# EAGLE schematic player (EAGLE 6.4)
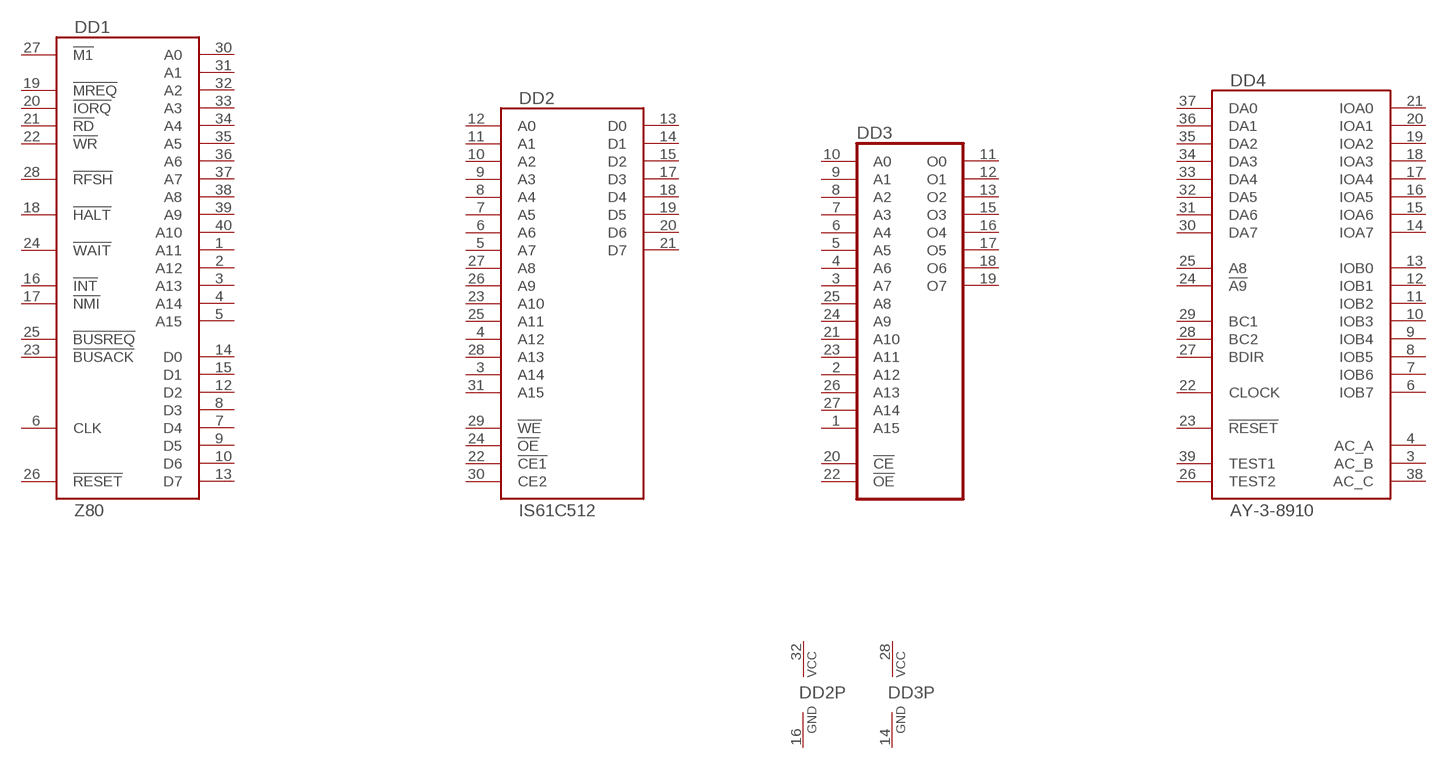
[diagram p0: schematic, sheet 1]

## Parts
DD1  Z80  [DIL40]
DD2  IS61C512  [DIL32-3]
DD3  27512  [DIL28]
DD4  AY-3-8910  [DIL40]
Unconnected: DD1.1(A11) DD1.2(A12) DD1.3(A13) DD1.4(A14) DD1.5(A15) DD1.6(CLK) DD1.7(D4) DD1.8(D3) DD1.9(D5) DD1.10(D6) DD1.12(D2) DD1.13(D7) DD1.14(D0) DD1.15(D1) DD1.16(!INT) DD1.17(!NMI) DD1.18(!HALT) DD1.19(!MREQ) DD1.20(!IORQ) DD1.21(!RD) DD1.22(!WR) DD1.23(!BUSACK) DD1.24(!WAIT) DD1.25(!BUSREQ) DD1.26(!RESET) DD1.27(!M1) DD1.28(!RFSH) DD1.30(A0) DD1.31(A1) DD1.32(A2) DD1.33(A3) DD1.34(A4) DD1.35(A5) DD1.36(A6) DD1.37(A7) DD1.38(A8) DD1.39(A9) DD1.40(A10) DD2.3(A14) DD2.4(A12) DD2.5(A7) DD2.6(A6) DD2.7(A5) DD2.8(A4) DD2.9(A3) DD2.10(A2) DD2.11(A1) DD2.12(A0) DD2.13(D0) DD2.14(D1) DD2.15(D2) DD2.17(D3) DD2.18(D4) DD2.19(D5) DD2.20(D6) DD2.21(D7) DD2.22(!CE1) DD2.23(A10) DD2.24(!OE) DD2.25(A11) DD2.26(A9) DD2.27(A8) DD2.28(A13) DD2.29(!WE) DD2.30(CE2) DD2.31(A15) DD3.1(A15) DD3.2(A12) DD3.3(A7) DD3.4(A6) DD3.5(A5) DD3.6(A4) DD3.7(A3) DD3.8(A2) DD3.9(A1) DD3.10(A0) DD3.11(O0) DD3.12(O1) DD3.13(O2) DD3.15(O3) DD3.16(O4) DD3.17(O5) DD3.18(O6) DD3.19(O7) DD3.20(!CE) DD3.21(A10) DD3.22(!OE) DD3.23(A11) DD3.24(A9) DD3.25(A8) DD3.26(A13) DD3.27(A14) DD4.3(AC_B) DD4.4(AC_A) DD4.6(IOB7) DD4.7(IOB6) DD4.8(IOB5) DD4.9(IOB4) DD4.10(IOB3) DD4.11(IOB2) DD4.12(IOB1) DD4.13(IOB0) DD4.14(IOA7) DD4.15(IOA6) DD4.16(IOA5) DD4.17(IOA4) DD4.18(IOA3) DD4.19(IOA2) DD4.20(IOA1) DD4.21(IOA0) DD4.22(CLOCK) DD4.23(!RESET) DD4.24(!A9) DD4.25(A8) DD4.26(TEST2) DD4.27(BDIR) DD4.28(BC2) DD4.29(BC1) DD4.30(DA7) DD4.31(DA6) DD4.32(DA5) DD4.33(DA4) DD4.34(DA3) DD4.35(DA2) DD4.36(DA1) DD4.37(DA0) DD4.38(AC_C) DD4.39(TEST1)

## Power pins joined to a net without a drawn wire
GND: DD1.29(GND) DD2.16(GND) DD3.14(GND) DD4.1(GND)
VCC: DD1.11(VCC) DD2.32(VCC) DD3.28(VCC) DD4.40(VCC)

## Library data of the parts
DD1 = oldschool:Z80
DD2 = oldschool:IS61C512
DD3 = memory:27512: MEMORY
DD4 = oldschool:AY-3-8910: analog YM2149F (but pin 26 divide clock)